# EAGLE design Final_Project_PCB (EAGLE 9.6.2)
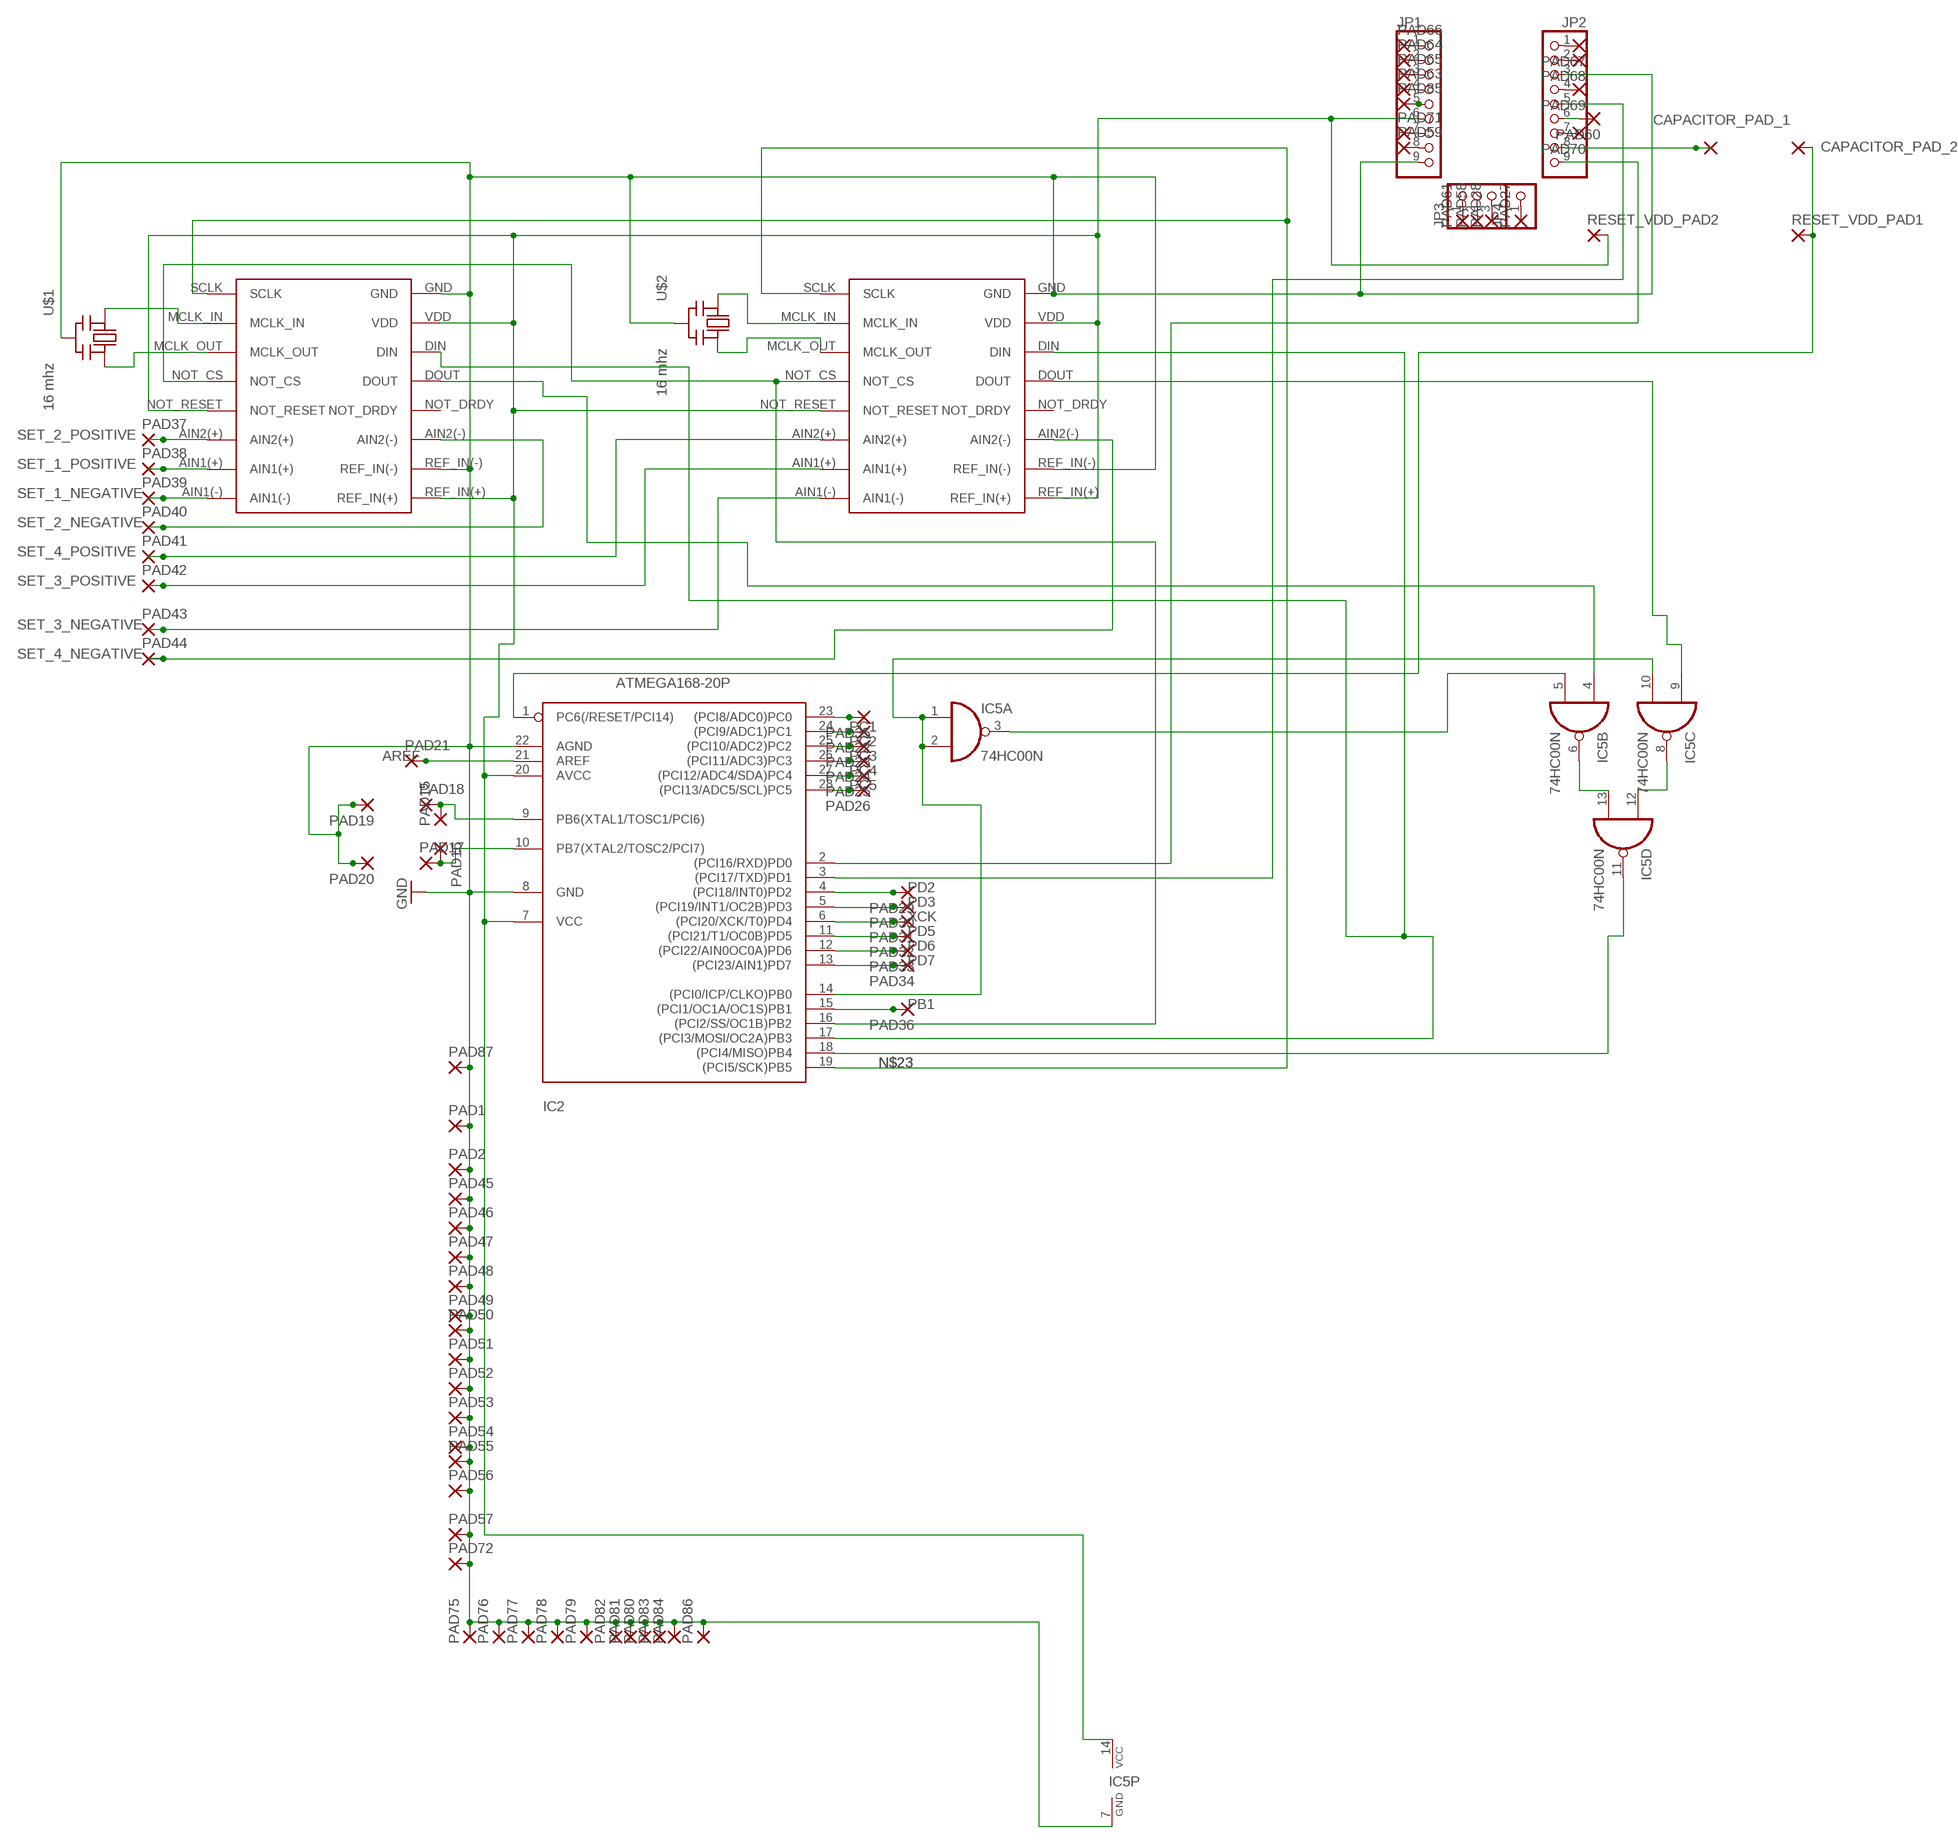
[diagram p0: schematic, sheet 1]

## Parts
AMPLIFIER1  AD7705BNZ  [AD7705BNZ]
AMPLIFIER2  AD7705BNZ  [AD7705BNZ]
CAPACITOR_PAD_1  1,6/0,8  [1,6/0,8]
CAPACITOR_PAD_2  1,6/0,8  [1,6/0,8]
IC2  ATMEGA168-20P  [DIL28-3]
IC5  74HC00N  [DIL14]
JP1  PINHD-1X9  [1X09-BIG]
JP2  PINHD-1X9  [1X09-BIG]
JP3  PINHD-1X3  [1X03]
JP4  PINHD-1X1  [1X01]
PAD1  1,6/0,8  [1,6/0,8]
PAD2  1,6/0,8  [1,6/0,8]
PAD15  1,6/0,8  [1,6/0,8]
PAD16  1,6/0,8  [1,6/0,8]
PAD17  1,6/0,8  [1,6/0,8]
PAD18  1,6/0,8  [1,6/0,8]
PAD19  1,6/0,8  [1,6/0,8]
PAD20  1,6/0,8  [1,6/0,8]
PAD21  1,6/0,8  [1,6/0,8]
PAD22  1,6/0,8  [1,6/0,8]
PAD23  1,6/0,8  [1,6/0,8]
PAD24  1,6/0,8  [1,6/0,8]
PAD25  1,6/0,8  [1,6/0,8]
PAD26  1,6/0,8  [1,6/0,8]
PAD27  1,6/0,8  [1,6/0,8]
PAD28  1,6/0,8  [1,6/0,8]
PAD29  1,6/0,8  [1,6/0,8]
PAD30  1,6/0,8  [1,6/0,8]
PAD31  1,6/0,8  [1,6/0,8]
PAD32  1,6/0,8  [1,6/0,8]
PAD33  1,6/0,8  [1,6/0,8]
PAD34  1,6/0,8  [1,6/0,8]
PAD35  1,6/0,8  [1,6/0,8]
PAD36  1,6/0,8  [1,6/0,8]
PAD37  1,6/0,8  [1,6/0,8]
PAD38  1,6/0,8  [1,6/0,8]
PAD39  1,6/0,8  [1,6/0,8]
PAD40  1,6/0,8  [1,6/0,8]
PAD41  1,6/0,8  [1,6/0,8]
PAD42  1,6/0,8  [1,6/0,8]
PAD43  1,6/0,8  [1,6/0,8]
PAD44  1,6/0,8  [1,6/0,8]
PAD45  1,6/0,8  [1,6/0,8]
PAD46  1,6/0,8  [1,6/0,8]
PAD47  1,6/0,8  [1,6/0,8]
PAD48  1,6/0,8  [1,6/0,8]
PAD49  1,6/0,8  [1,6/0,8]
PAD50  1,6/0,8  [1,6/0,8]
PAD51  1,6/0,8  [1,6/0,8]
PAD52  1,6/0,8  [1,6/0,8]
PAD53  1,6/0,8  [1,6/0,8]
PAD54  1,6/0,8  [1,6/0,8]
PAD55  1,6/0,8  [1,6/0,8]
PAD56  1,6/0,8  [1,6/0,8]
PAD57  1,6/0,8  [1,6/0,8]
PAD58  1,6/0,8  [1,6/0,8]
PAD59  1,6/0,8  [1,6/0,8]
PAD60  1,6/0,8  [1,6/0,8]
PAD61  1,6/0,8  [1,6/0,8]
PAD63  1,6/0,8  [1,6/0,8]
PAD64  1,6/0,8  [1,6/0,8]
PAD65  1,6/0,8  [1,6/0,8]
PAD66  1,6/0,8  [1,6/0,8]
PAD67  1,6/0,8  [1,6/0,8]
PAD68  1,6/0,8  [1,6/0,8]
PAD69  1,6/0,8  [1,6/0,8]
PAD70  1,6/0,8  [1,6/0,8]
PAD71  1,6/0,8  [1,6/0,8]
PAD72  1,6/0,8  [1,6/0,8]
PAD75  1,6/0,8  [1,6/0,8]
PAD76  1,6/0,8  [1,6/0,8]
PAD77  1,6/0,8  [1,6/0,8]
PAD78  1,6/0,8  [1,6/0,8]
PAD79  1,6/0,8  [1,6/0,8]
PAD80  1,6/0,8  [1,6/0,8]
PAD81  1,6/0,8  [1,6/0,8]
PAD82  1,6/0,8  [1,6/0,8]
PAD83  1,6/0,8  [1,6/0,8]
PAD84  1,6/0,8  [1,6/0,8]
PAD85  1,6/0,8  [1,6/0,8]
PAD86  1,6/0,8  [1,6/0,8]
PAD87  1,6/0,8  [1,6/0,8]
RESET_VDD_PAD1  1,6/0,8  [1,6/0,8]
RESET_VDD_PAD2  1,6/0,8  [1,6/0,8]
U$1  16 mhz  CERMOSCILL-THM  [CERM_OSC]
U$2  16 mhz  CERMOSCILL-THM  [CERM_OSC]

## Nets
AREF: IC2.21(AREF) PAD21.1(P)
GND: AMPLIFIER1.GND AMPLIFIER1.REF_IN(-) AMPLIFIER2.GND AMPLIFIER2.REF_IN(-) IC2.8(GND) IC2.22(AGND) IC5.7(P:GND) JP1.9 JP2.3 PAD1.1(P) PAD2.1(P) PAD19.1(P) PAD20.1(P) PAD45.1(P) PAD46.1(P) PAD47.1(P) PAD48.1(P) PAD49.1(P) PAD50.1(P) PAD51.1(P) PAD52.1(P) PAD53.1(P) PAD54.1(P) PAD55.1(P) PAD56.1(P) PAD57.1(P) PAD72.1(P) PAD75.1(P) PAD76.1(P) PAD77.1(P) PAD78.1(P) PAD79.1(P) PAD80.1(P) PAD81.1(P) PAD82.1(P) PAD83.1(P) PAD84.1(P) PAD86.1(P) PAD87.1(P) U$1.P$2(GND) U$2.P$2(GND)
N$1: AMPLIFIER1.MCLK_IN U$1.P$1(IN)
N$2: JP4.1 PAD27.1(P)
N$3: AMPLIFIER1.MCLK_OUT U$1.P$3(OUT)
N$5: JP3.3 PAD28.1(P)
N$6: AMPLIFIER2.MCLK_IN U$2.P$1(IN)
N$7: IC2.18((PCI4/MISO)PB4) IC5.11(D:O)
N$8: AMPLIFIER1.NOT_CS AMPLIFIER2.NOT_CS IC2.16((PCI2/SS/OC1B)PB2)
N$9: AMPLIFIER1.DIN AMPLIFIER2.DIN IC2.17((PCI3/MOSI/OC2A)PB3)
N$10: AMPLIFIER2.DOUT IC5.9(C:I0)
N$11: AMPLIFIER1.DOUT IC5.4(B:I0)
N$12: JP2.6 PAD60.1(P)
N$13: IC5.3(A:O) IC5.5(B:I1)
N$14: IC5.6(B:O) IC5.13(D:I1)
N$15: IC5.8(C:O) IC5.12(D:I0)
N$16: JP3.2 PAD58.1(P)
N$17: IC2.9(PB6(XTAL1/TOSC1/PCI6)) PAD15.1(P) PAD18.1(P)
N$18: IC2.10(PB7(XTAL2/TOSC2/PCI7)) PAD16.1(P) PAD17.1(P)
N$19: JP1.8 PAD59.1(P)
N$20: AMPLIFIER2.MCLK_OUT U$2.P$3(OUT)
N$21: JP3.1 PAD61.1(P)
N$22: JP1.5 PAD85.1(P)
N$23: AMPLIFIER1.SCLK AMPLIFIER2.SCLK IC2.19((PCI5/SCK)PB5)
N$24: JP1.4 PAD63.1(P)
N$25: JP1.2 PAD64.1(P)
N$26: JP1.3 PAD65.1(P)
N$27: JP1.1 PAD66.1(P)
N$28: JP2.1 PAD67.1(P)
N$29: JP2.2 PAD68.1(P)
N$30: JP2.4 PAD69.1(P)
N$31: JP2.7 PAD70.1(P)
N$32: CAPACITOR_PAD_1.1(P) JP2.8
N$33: CAPACITOR_PAD_2.1(P) IC2.1(PC6(/RESET/PCI14)) RESET_VDD_PAD1.1(P)
N$34: AMPLIFIER1.NOT_RESET AMPLIFIER1.REF_IN(+) AMPLIFIER1.VDD AMPLIFIER2.NOT_RESET AMPLIFIER2.REF_IN(+) AMPLIFIER2.VDD IC2.7(VCC) IC2.20(AVCC) IC5.14(P:VCC) JP1.6 RESET_VDD_PAD2.1(P)
N$35: IC2.23((PCI8/ADC0)PC0) PAD35.1(P)
N$36: JP1.7 PAD71.1(P)
PB0: IC2.14((PCI0/ICP/CLKO)PB0) IC5.1(A:I0) IC5.2(A:I1) IC5.10(C:I1)
PB1: IC2.15((PCI1/OC1A/OC1S)PB1) PAD36.1(P)
PC1: IC2.24((PCI9/ADC1)PC1) PAD22.1(P)
PC2: IC2.25((PCI10/ADC2)PC2) PAD23.1(P)
PC3: IC2.26((PCI11/ADC3)PC3) PAD24.1(P)
PC4: IC2.27((PCI12/ADC4/SDA)PC4) PAD25.1(P)
PC5: IC2.28((PCI13/ADC5/SCL)PC5) PAD26.1(P)
PD2: IC2.4((PCI18/INT0)PD2) PAD29.1(P)
PD3: IC2.5((PCI19/INT1/OC2B)PD3) PAD30.1(P)
PD5: IC2.11((PCI21/T1/OC0B)PD5) PAD32.1(P)
PD6: IC2.12((PCI22/AIN0OC0A)PD6) PAD33.1(P)
PD7: IC2.13((PCI23/AIN1)PD7) PAD34.1(P)
RXD: IC2.2((PCI16/RXD)PD0) JP2.9
SET_1_NEGATIVE: AMPLIFIER1.AIN1(-) PAD39.1(P)
SET_1_POSITIVE: AMPLIFIER1.AIN1(+) PAD38.1(P)
SET_2_NEGATIVE: AMPLIFIER1.AIN2(-) PAD40.1(P)
SET_2_POSITIVE: AMPLIFIER1.AIN2(+) PAD37.1(P)
SET_3_NEGATIVE: AMPLIFIER2.AIN1(-) PAD43.1(P)
SET_3_POSITIVE: AMPLIFIER2.AIN1(+) PAD42.1(P)
SET_4_NEGATIVE: AMPLIFIER2.AIN2(-) PAD44.1(P)
SET_4_POSITIVE: AMPLIFIER2.AIN2(+) PAD41.1(P)
TXD: IC2.3((PCI17/TXD)PD1) JP2.5
XCK: IC2.6((PCI20/XCK/T0)PD4) PAD31.1(P)
Unconnected: AMPLIFIER1.NOT_DRDY AMPLIFIER2.NOT_DRDY

## Library data of the parts
AMPLIFIER1 AMPLIFIER2 = AD7705BNZ_LIB:AD7705BNZ
CAPACITOR_PAD_1 CAPACITOR_PAD_2 PAD1 PAD2 PAD15-PAD61 PAD63-PAD72 PAD75-PAD87 RESET_VDD_PAD1 RESET_VDD_PAD2 = wirepad:1,6/0,8: THROUGH-HOLE PAD
IC2 = adafruit:ATMEGA168*P: MICROCONTROLLER 16 kBytes FLASH 1 kBytes SRAM 512 Bytes EEPROM USART 8-channel 10 bit ADC
IC5 = 74xx-eu:74*00: Quad 2-input NAND gate
JP1 JP2 = adafruit:PINHD-1X9: Pin header 1x10 0.1" spacing With round pins
JP3 = adafruit:PINHD-1X3: PIN HEADER
JP4 = adafruit:PINHD-1X1: Pin header 1x1 for 0.1" spacing With round pins
U$1 U$2 = adafruit:CERMOSCILL: Ceramic oscillator with built in capacitors such as ZTT-12MHz http://www.ladyada.net/library/eagle

## Net classes
0 default: width 0.203 mm
1 power: width 0.254 mm

## Board
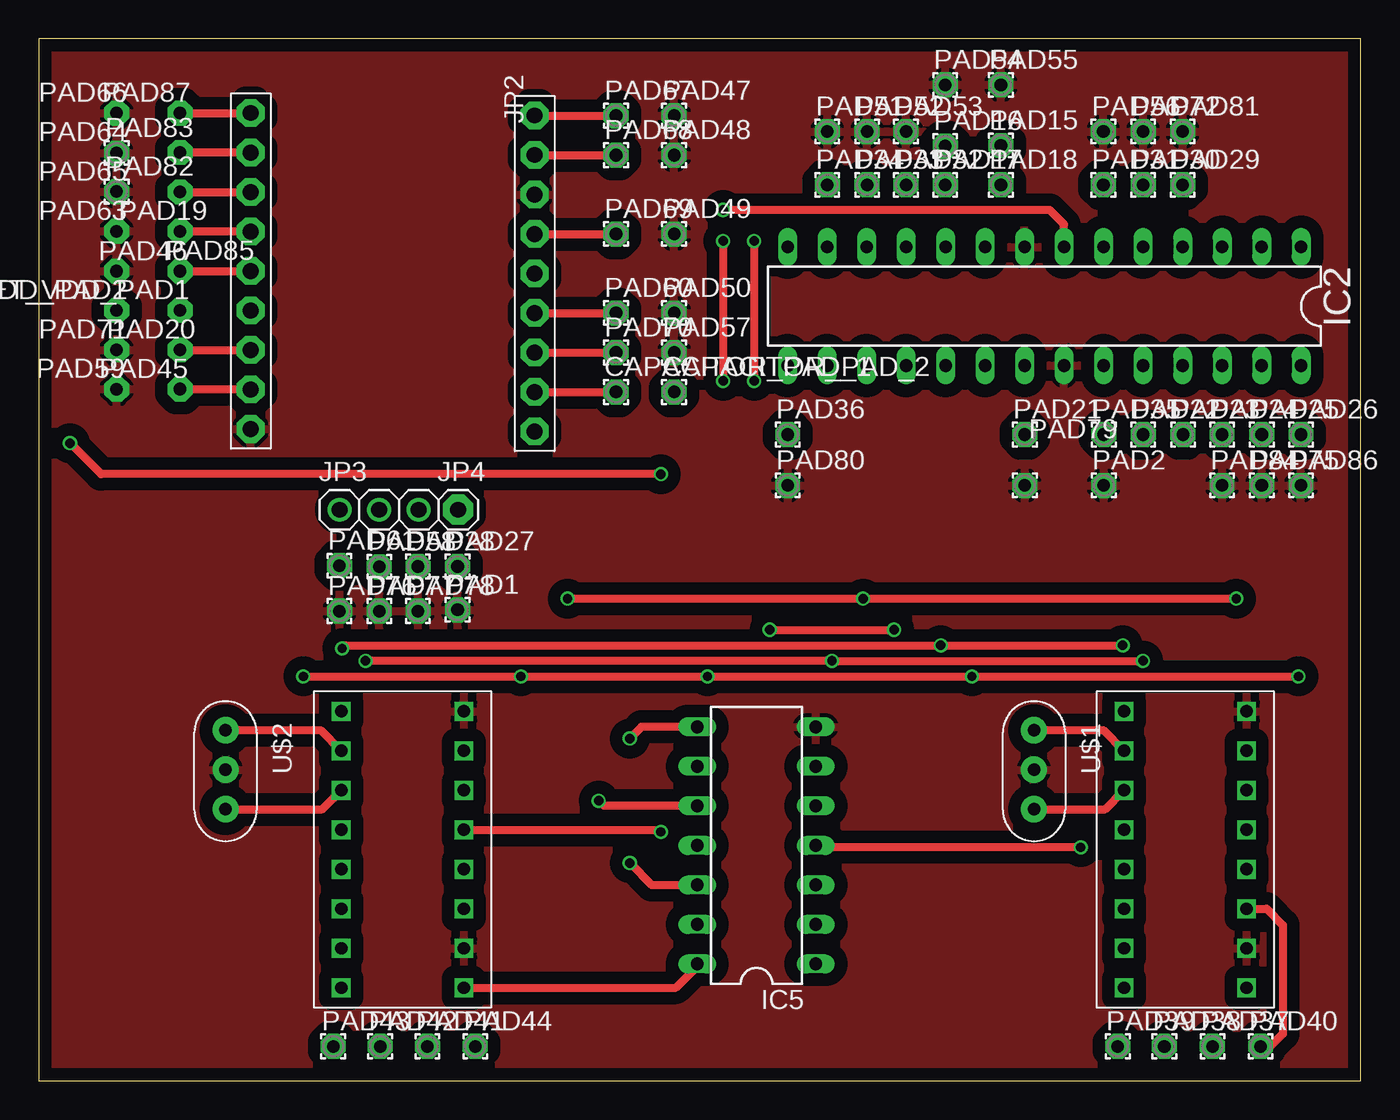
[diagram p1: board, top side]
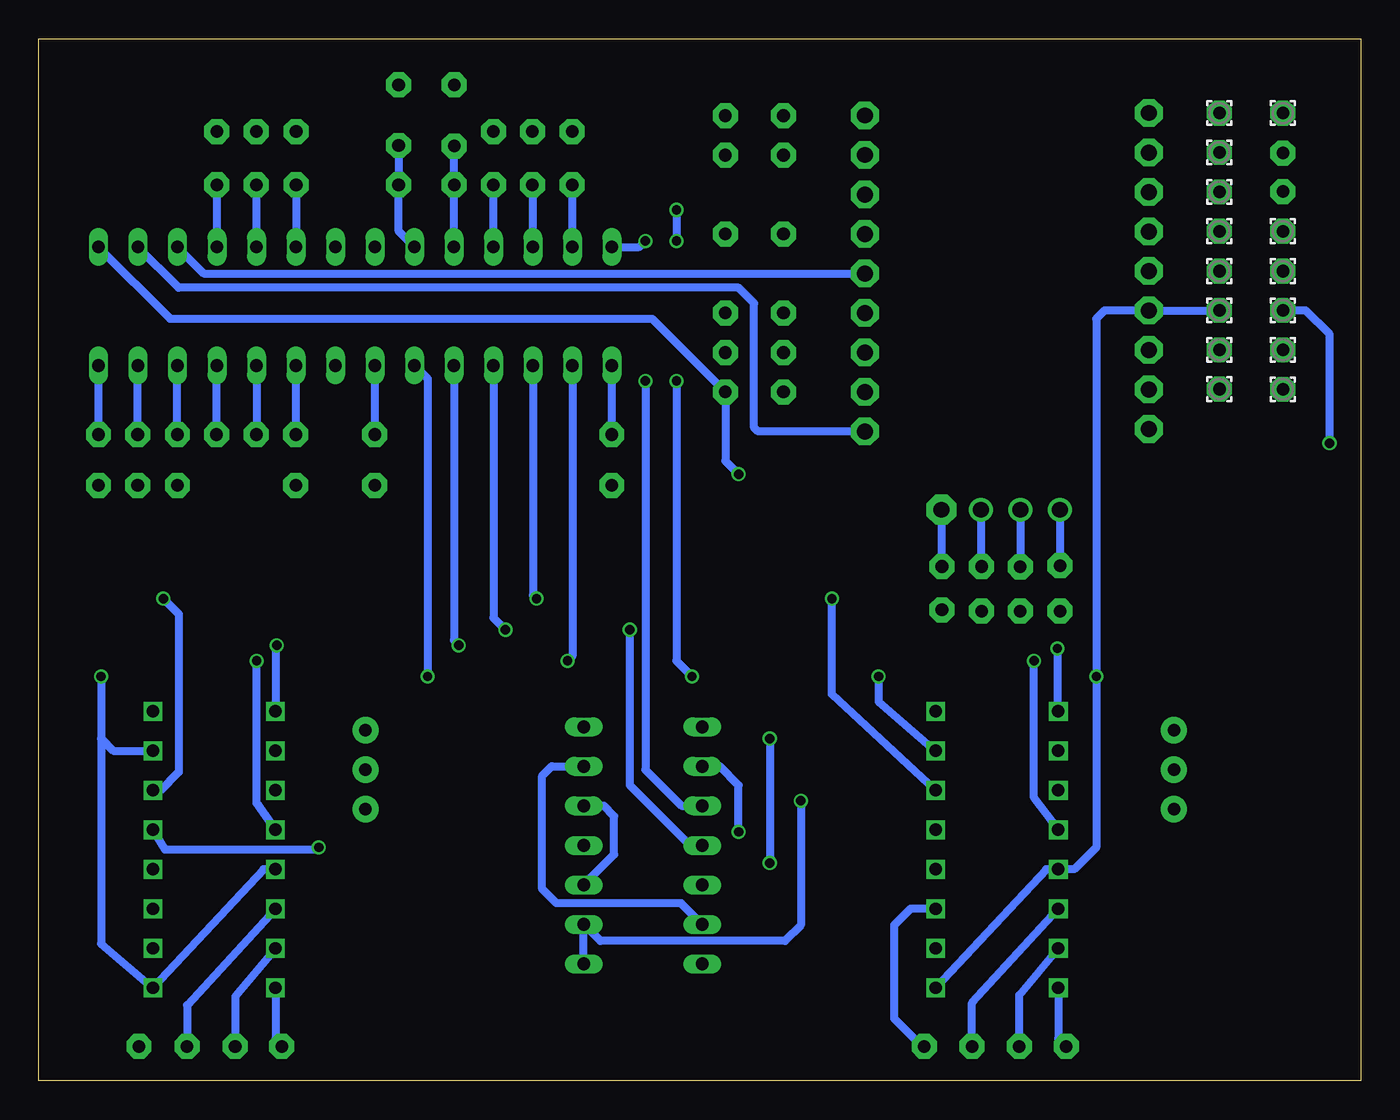
[diagram p2: board, bottom side, seen from below]

Size 85 x 67 mm. Coordinates in mm from the lower left corner, seen from the top.
Outline: 0,0 85,0 85,67 0,67 0,0
Copper layers (1*16): Top 0.035mm / dielectric 1.5mm / Bottom 0.035mm
Design rules "PCBWay_2layer": minimum track width 6mil, minimum drill 0.3mm, track to track 6mil, track to pad 6mil, pad to pad 6mil, via to via 6mil, smd to smd 4mil, copper to edge 10mil, drill to drill 6mil, minimum pad ring 6mil, minimum via ring 6mil, stop-mask expansion 4mil, vias tented up to drill 0.8mm, thermal gap 10mil

### Footprints (pad centres in the part's own frame; a part is rotated, then mirrored left to right if it is on the bottom)
AD7705BNZ = drill 0.8 square: AIN1(+) -3.31,-8.89; AIN1(-) -3.31,-11.43; AIN2(+) -3.31,-6.35; AIN2(-) 4.58,-6.35; DIN 4.58,1.27; DOUT 4.58,-1.27; GND 4.58,6.35; MCLK_IN -3.31,3.81; MCLK_OUT -3.31,1.27; NOT_CS -3.31,-1.27; NOT_DRDY 4.58,-3.81; NOT_RESET -3.31,-3.81; REF_IN(+) 4.58,-11.43; REF_IN(-) 4.58,-8.89; SCLK -3.31,6.35; VDD 4.58,3.81
1,6/0,8 = drill 0.813 pad 1.6 octagon: 1 0,0
DIL28-3 = drill 0.813 long: 1 -16.51,-3.81; 2 -13.97,-3.81; 3 -11.43,-3.81; 4 -8.89,-3.81; 5 -6.35,-3.81; 6 -3.81,-3.81; 7 -1.27,-3.81; 8 1.27,-3.81; 9 3.81,-3.81; 10 6.35,-3.81; 11 8.89,-3.81; 12 11.43,-3.81; 13 13.97,-3.81; 14 16.51,-3.81; 15 16.51,3.81; 16 13.97,3.81; 17 11.43,3.81; 18 8.89,3.81; 19 6.35,3.81; 20 3.81,3.81; 21 1.27,3.81; 22 -1.27,3.81; 23 -3.81,3.81; 24 -6.35,3.81; 25 -8.89,3.81; 26 -11.43,3.81; 27 -13.97,3.81; 28 -16.51,3.81
DIL14 = drill 0.813 long: 1 -7.62,-3.81; 2 -5.08,-3.81; 3 -2.54,-3.81; 4 0,-3.81; 5 2.54,-3.81; 6 5.08,-3.81; 7 7.62,-3.81; 8 7.62,3.81; 9 5.08,3.81; 10 2.54,3.81; 11 0,3.81; 12 -2.54,3.81; 13 -5.08,3.81; 14 -7.62,3.81
1X09-BIG = drill 1.016 pad 1.778 octagon: 1 -10.16,0; 2 -7.62,0; 3 -5.08,0; 4 -2.54,0; 5 0,0; 6 2.54,0; 7 5.08,0; 8 7.62,0; 9 10.16,0
1X03 = drill 1.016: 1 -2.54,0; 2 0,0; 3 2.54,0
1X01 = drill 1.016 pad 1.93 octagon: 1 0,0
CERM_OSC = drill 0.813 pad 1.676: P$1 -2.54,0; P$2 0,0; P$3 2.54,0

### Placement (x,y rotation side)
AMPLIFIER1  73.09,17.4 0 top
AMPLIFIER2  22.75,17.4 0 top
CAPACITOR_PAD_1  37.11,44.29 0 top
CAPACITOR_PAD_2  40.85,44.29 0 top
IC2  64.66,49.8 180 top
IC5  46.15,15.13 90 top
JP1  13.62,52.07 270 top
JP2  31.88,51.91 270 top
JP3  21.88,36.72 0 top
JP4  26.96,36.72 0 top
PAD1  26.93,30.28 0 top
PAD2  68.48,38.28 0 top
PAD15  61.86,60.15 0 top
PAD16  58.29,60.11 0 top
PAD17  58.29,57.61 0 top
PAD18  61.86,57.61 0 top
PAD19  5,54.63 180 bottom
PAD20  5,47 180 bottom
PAD21  63.4,41.55 0 top
PAD22  71.02,41.55 0 top
PAD23  73.57,41.55 0 top
PAD24  76.09,41.55 0 top
PAD25  78.65,41.55 0 top
PAD26  81.17,41.55 0 top
PAD27  26.93,33.07 0 top
PAD28  24.38,33.07 0 top
PAD29  73.56,57.61 0 top
PAD30  71.02,57.61 0 top
PAD31  68.45,57.61 0 top
PAD32  55.76,57.61 0 top
PAD33  53.26,57.61 0 top
PAD34  50.7,57.61 0 top
PAD35  68.48,41.55 0 top
PAD36  48.16,41.55 0 top
PAD37  75.47,2.2 0 top
PAD38  72.37,2.2 0 top
PAD39  69.38,2.2 0 top
PAD40  78.56,2.2 0 top
PAD41  24.99,2.2 0 top
PAD42  21.95,2.2 0 top
PAD43  18.93,2.2 0 top
PAD44  28.06,2.2 0 top
PAD45  5,44.46 180 bottom
PAD46  5,52.06 180 bottom
PAD47  40.85,62.06 0 top
PAD48  40.85,59.52 0 top
PAD49  40.85,54.45 0 top
PAD50  40.85,49.37 0 top
PAD51  50.7,61.04 0 top
PAD52  53.26,61.04 0 top
PAD53  55.76,61.04 0 top
PAD54  58.29,64.04 0 top
PAD55  61.86,64.04 0 top
PAD56  68.45,61.04 0 top
PAD57  40.85,46.83 0 top
PAD58  21.89,33.05 0 top
PAD59  9.08,44.48 180 bottom
PAD60  37.11,49.37 0 top
PAD61  19.33,33.12 0 top
PAD63  9.08,54.63 180 bottom
PAD64  9.08,59.7 180 bottom
PAD65  9.08,57.16 180 bottom
PAD66  9.08,62.23 180 bottom
PAD67  37.11,62.06 0 top
PAD68  37.11,59.52 0 top
PAD69  37.11,54.45 0 top
PAD70  37.11,46.83 0 top
PAD71  9.08,47 180 bottom
PAD72  71.02,61.04 0 top
PAD75  78.65,38.28 0 top
PAD76  19.33,30.2 0 top
PAD77  21.89,30.2 0 top
PAD78  24.38,30.2 0 top
PAD79  63.4,38.28 0 top
PAD80  48.16,38.28 0 top
PAD81  73.56,61.04 0 top
PAD82  5,57.18 0 top
PAD83  5,59.66 0 top
PAD84  76.09,38.28 0 top
PAD85  9.08,52.06 180 bottom
PAD86  81.17,38.28 0 top
PAD87  5,62.23 180 bottom
RESET_VDD_PAD1  5,49.54 180 bottom
RESET_VDD_PAD2  9.08,49.54 180 bottom
U$1  64,20 270 top
U$2  12,20 270 top

### Tracks (layer width: path | path; a pad name or v marks a point on that pad's centre or on a via)
AREF
  Bottom 0.508: PAD21.1 63.39,41.57 IC2.21
GND
  pour Top (isolate 0.813): 0,67 0,0 85,0 85,67
N$1
  Top 0.508: U$1.P$1 68.45,22.54 AMPLIFIER1.MCLK_IN
N$2
  Bottom 0.508: JP4.1 26.96,33.1 PAD27.1
N$3
  Top 0.508: U$1.P$3 68.57,17.46 AMPLIFIER1.MCLK_OUT
N$5
  Bottom 0.508: JP3.3 24.42,33.11 PAD28.1
N$6
  Top 0.508: U$2.P$1 18.11,22.54 AMPLIFIER2.MCLK_IN
N$7  (via drill 0.6)
  Top 0.508: v47,29 v55,29
  Bottom 0.508: IC5.11 43.13,15.13 47,19 v47,29 | IC2.18 55.77,29.77 v55,29
N$8  (via drill 0.6)
  Top 0.508: v21,27 v51,27 v71,27
  Bottom 0.508: AMPLIFIER1.NOT_CS 71,17.85 v71,27 | AMPLIFIER2.NOT_CS 21,18.19 v21,27 | IC2.16 50.69,27.31 v51,27
N$9  (via drill 0.6)
  Top 0.508: v77,31 v53,31 v34,31
  Bottom 0.508: AMPLIFIER1.DIN 77.17,18.67 76,19.84 76,30 v77,31 | AMPLIFIER2.DIN 34,24.84 v34,31 | IC2.17 53.23,31.23 v53,31
N$10  (via drill 0.6)
  Top 0.508: AMPLIFIER2.DOUT 39.87,16.13 v40,16
  Bottom 0.508: v40,16 40,19 41.21,20.21 IC5.9
N$11  (via drill 0.6)
  Top 0.508: v67,15 50.09,15 IC5.4
  Bottom 0.508: AMPLIFIER1.DOUT 76.91,14.87 67.01,14.87 67,14.88 v67,15
N$12
  Top 0.508: JP2.6 PAD60.1
N$13
  Bottom 0.508: IC5.3 48,14.55 48,17 48.67,17.67 IC5.5
N$14
  Bottom 0.508: IC5.13 43.7,11.41 51.72,11.41 52.64,12.33 52.64,19.6 52.03,20.21 IC5.6
N$15  (via drill 0.6)
  Top 0.508: IC5.8 38.75,22.75 v38,22 | v38,14 39.41,12.59 IC5.12
  Bottom 0.508: v38,22 v38,14
N$16
  Bottom 0.508: JP3.2 PAD58.1
N$17
  Bottom 0.508: IC2.9 61.86,54.62 PAD18.1 PAD15.1
N$18
  Bottom 0.508: IC2.10 58.31,57.59 PAD17.1 PAD16.1
N$19
  Top 0.508: PAD59.1 13.59,44.48 JP1.8
N$20
  Top 0.508: U$2.P$3 18.23,17.46 AMPLIFIER2.MCLK_OUT
N$21
  Bottom 0.508: JP3.1 PAD61.1
N$22
  Top 0.508: JP1.5 13.61,52.06 PAD85.1
N$23  (via drill 0.6)
  Top 0.508: v69.7,28 v58,28 19.7,28 v19.5,27.8
  Bottom 0.508: AMPLIFIER2.SCLK 19.5,23.81 v19.5,27.8 | v69.7,28 69.78,27.92 AMPLIFIER1.SCLK | IC2.19 58.31,28.31 v58,28
N$24
  Top 0.508: JP1.4 9.1,54.61 PAD63.1
N$25
  Top 0.508: PAD64.1 JP1.2
N$26
  Top 0.508: PAD65.1 JP1.3
N$27
  Top 0.508: PAD66.1 JP1.1
N$28
  Top 0.508: JP2.1 37.1,62.07 PAD67.1
N$29
  Top 0.508: JP2.2 PAD68.1
N$30
  Top 0.508: JP2.4 PAD69.1
N$31
  Top 0.508: JP2.7 PAD70.1
N$32
  Top 0.508: JP2.8 | JP2.8 CAPACITOR_PAD_1.1
N$33  (via drill 0.6)
  Top 0.508: v40,39 4,39 v2,41
  Bottom 0.508: IC2.1 76.56,49 45.56,49 CAPACITOR_PAD_2.1 40.85,39.85 v40,39 | v2,41 2,48 3.54,49.54 RESET_VDD_PAD1.1
N$34  (via drill 0.6)
  Top 0.508: AMPLIFIER2.REF_IN(+) 40.97,5.97 42.34,7.34 IC5.14 | v17,26 v31,26 v43,26 v60,26 60,25.97 80.97,25.97 v81,26 | IC2.7 65.93,55.07 65,56 v44,56 | v44,54 v44,45
  Bottom 0.508: RESET_VDD_PAD2.1 JP1.6 16.47,49.53 17,49 v17,26 17,15 18.41,13.59 AMPLIFIER2.NOT_RESET 20.21,13.59 AMPLIFIER2.REF_IN(+) | IC2.20 60,45.14 v60,26 | v81,26 81,22 | 81,22 80.21,21.21 AMPLIFIER1.VDD | v31,26 31,24.38 AMPLIFIER2.VDD | AMPLIFIER1.NOT_RESET 70.55,13.59 AMPLIFIER1.REF_IN(+) 81,8.8 81,22 | v44,56 v44,54 | v44,45 44,27 v43,26
N$35
  Bottom 0.508: PAD35.1 68.47,41.57 IC2.23
N$36
  Top 0.508: PAD71.1 JP1.7
PB0  (via drill 0.6)
  Top 0.508: IC5.10 36.33,17.67 v36,18 | v46,54 v46,45
  Bottom 0.508: v36,18 36,10 37.02,8.98 48.89,8.98 IC5.2 | IC5.2 | IC5.10 43.67,17.67 46,20 v46,45 | IC5.1 IC5.2 | v46,54 46.39,53.61 IC2.14
PB1
  Bottom 0.508: PAD36.1 IC2.15
PC1
  Bottom 0.508: IC2.24 PAD22.1
PC2
  Bottom 0.508: PAD23.1 73.57,45.97 IC2.25
PC3
  Bottom 0.508: PAD24.1 IC2.26
PC4
  Bottom 0.508: PAD25.1 78.65,45.97 IC2.27
PC5
  Bottom 0.508: IC2.28 PAD26.1
PD2
  Bottom 0.508: PAD29.1 IC2.4
PD3
  Bottom 0.508: IC2.5 PAD30.1
PD5
  Bottom 0.508: IC2.11 PAD32.1
PD6
  Bottom 0.508: PAD33.1 53.26,53.64 IC2.12
PD7
  Bottom 0.508: IC2.13 PAD34.1
RXD
  Bottom 0.508: JP2.9 38.75,41.75 39,42 39,50 40,51 76.02,51 IC2.2
SET_1_NEGATIVE
  Bottom 0.508: AMPLIFIER1.AIN1(-) 69.78,2.67 69.77,2.59 PAD39.1
SET_1_POSITIVE
  Bottom 0.508: AMPLIFIER1.AIN1(+) 72.37,5.42 PAD38.1
SET_2_NEGATIVE
  Top 0.508: AMPLIFIER1.AIN2(-) 78.95,11.05 80,10 80,3 79.2,2.2 PAD40.1
SET_2_POSITIVE
  Bottom 0.508: AMPLIFIER1.AIN2(+) 75.47,4.86 PAD37.1
SET_3_NEGATIVE
  Bottom 0.508: AMPLIFIER2.AIN1(-) 19.44,2.71 PAD43.1
SET_3_POSITIVE
  Bottom 0.508: PAD42.1 21.95,5.5 AMPLIFIER2.AIN1(+)
SET_4_NEGATIVE
  Bottom 0.508: AMPLIFIER2.AIN2(-) 28.95,11.05 30,10 30,4 28.2,2.2 PAD44.1
SET_4_POSITIVE
  Bottom 0.508: PAD41.1 24.99,5 AMPLIFIER2.AIN2(+)
TXD
  Bottom 0.508: IC2.3 74.39,51.91 JP2.5
XCK
  Bottom 0.508: PAD31.1 68.45,53.63 IC2.6